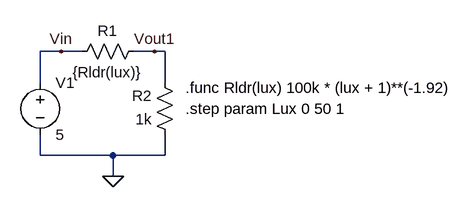
[diagram p0: schematic ACTIVIDAD4-LDR.asc]
ACTIVIDAD4-LDR.asc, the LTspice schematic file:
Version 4.1
SHEET 1 1056 680
WIRE 112 -48 80 -48
WIRE 144 -48 112 -48
WIRE 256 -48 224 -48
WIRE 272 -48 256 -48
WIRE 80 0 80 -48
WIRE 272 0 272 -48
WIRE 80 112 80 80
WIRE 192 112 80 112
WIRE 272 112 272 80
WIRE 272 112 192 112
WIRE 192 144 192 112
FLAG 256 -48 Vout1
FLAG 192 144 0
FLAG 112 -48 Vin
SYMBOL res 240 -64 R90
WINDOW 0 0 56 VBottom 2
WINDOW 3 32 56 VTop 2
SYMATTR InstName R1
SYMATTR Value {Rldr(lux)}
SYMBOL res 288 96 R180
WINDOW 0 36 76 Left 2
WINDOW 3 36 40 Left 2
SYMATTR InstName R2
SYMATTR Value 1k
SYMBOL voltage 80 -16 R0
WINDOW 123 0 0 Left 0
WINDOW 39 0 0 Left 0
SYMATTR InstName V1
SYMATTR Value 5
TEXT 304 8 Left 2 !.func Rldr(lux) 100k * (lux + 1)**(-1.92)
TEXT 304 40 Left 2 !.step param Lux 0 50 1

The netlist it stands for:
* ACTIVIDAD4-LDR.asc
R1 Vout1 Vin {Rldr(lux)}
R2 0 Vout1 1k
V1 Vin 0 5
.func Rldr(lux) 100k * (lux + 1)**(-1.92)
.step param Lux 0 50 1
.backanno
.end